# Altium schematic sheet deel3.SchDoc
size A4; SheetNumber: 3; SheetTotal: 4
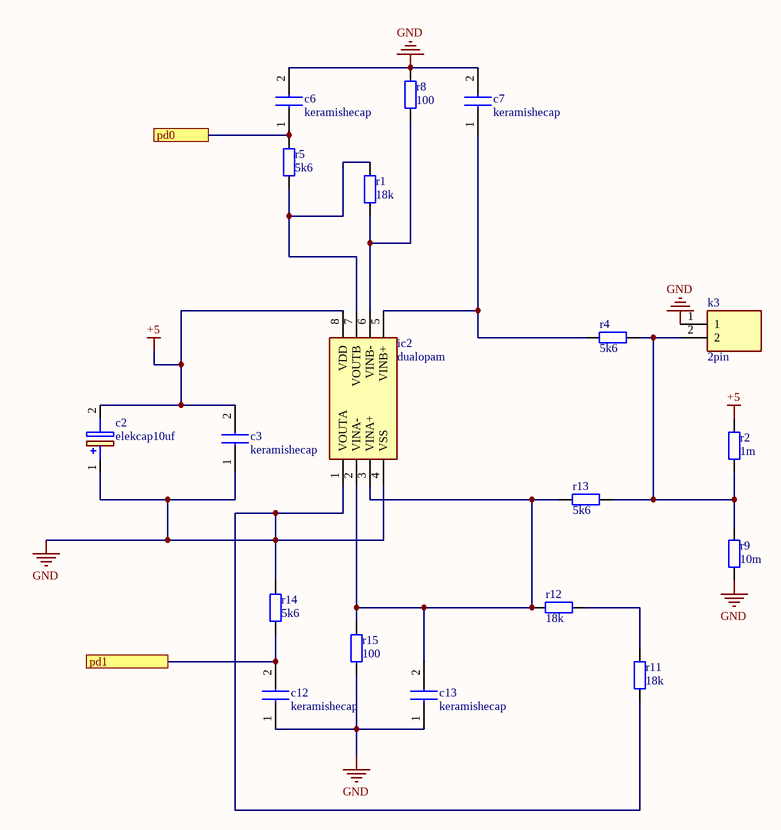
[diagram p0: deel3.SchDoc]

## Parts
c2  elekcap10uf  [elekcap10uf]
c3  keramishecap  [0805]
c6  keramishecap  [0805]
c7  keramishecap  [0805]
c12  keramishecap  [0805]
c13  keramishecap  [0805]
ic2  dualopam  [dualopam]
k3  2pin  [2pin]
r1  18k  [0805]
r2  1m  [0805]
r4  5k6  [0805]
r5  5k6  [0805]
r8  100  [0805]
r9  10m  [0805]
r11  18k  [0805]
r12  18k  [0805]
r13  5k6  [0805]
r14  5k6  [0805]
r15  100  [0805]

## Ports
pd0, pd1

## Nets
+5: c2.2(-) c3.2 ic2.8(VDD) r2.2
GND: c2.1(+) c3.1 c6.2 c7.2 c12.1 c13.1 ic2.1(VOUTA) ic2.4(VSS) k3.1 r8.2 r9.1 r11.1 r14.2 r15.1
pd0: c6.1 r5.1 ; port pd0
pd1: c12.2 r14.1 ; port pd1
Netc7_1: c7.1 ic2.5(VINB+) r4.1
Netc13_2: c13.2 ic2.2(VINA-) ic2.3(VINA+) r12.1 r13.1 r15.2
Netic2_6: ic2.6(VINB-) r1.1 r8.1
Netic2_7: ic2.7(VOUTB) r1.2 r5.2
Netk3_2: k3.2 r2.1 r4.2 r9.2 r13.2
Netr11_2: r11.2 r12.2

## Library data of the parts
c2 = elekcap10uf: Capacitor Polarised; Manufacturer_Name: Panasonic; Manufacturer_Part_Number: EEU-FR1H100; Datasheet Link: https://componentsearchengine.com//EEU-FR1H100.pdf; Height: 12.5mm; Mouser2 Part Number: 667-EEU-FR1H100; Mouser2 Price/Stock: https://www.mouser.com/Search/Refine.aspx?Keyword=667-EEU-FR1H100
c3 c6 c7 c12 c13 = keramishecap: Capacitor; Manufacturer_Name: Kemet; Manufacturer_Part_Number: C1206C104K3GACAUTO; Datasheet Link: https://www.kemet.com/specsheet/C1206C104K3GACAUTO; Height: 1.8mm
ic2 = dualopam: Integrated Circuit; Manufacturer_Name: Microchip; Manufacturer_Part_Number: MCP6002-E/P; Datasheet Link: https://componentsearchengine.com//MCP6002-E_P.pdf; Height: 5.334mm; Mouser2 Part Number: 579-MCP6002-E/P; Mouser2 Price/Stock: https://www.mouser.com/Search/Refine.aspx?Keyword=579-MCP6002-E%2FP
k3 = 2pin: Connector; Manufacturer_Name: Amphenol; Manufacturer_Part_Number: 10129378-902001BLF; Datasheet Link: https://www.mouser.co.uk/datasheet/2/18/10129378-1530218.pdf; Height: 8.43mm
r1 r2 r4 r5 r8 r9 r11-r15 = weerstand0805: WRIS-PSMB SMT Metal Plate Resistor, size 0805, 5mOhm, 0.5W; Manufacturer: Wurth Elektronik; Manufacturer Part Number: 580060720003; Rated Current: 10A; Temperature Coefficient of Resistance: +/-100ppm/degC; Technical Reference: MB0805R005F102KAATP0000; Resistance Tolerance: +/-1%; ComponentLink1Description: Manufacturer; ComponentLink1URL: http://www.we-online.de; ComponentLink2Description: Datasheet; ComponentLink2URL: https://www.we-online.com/catalog/datasheet/580060720003.pdf; Rated Power: 0.5W; Resistance: 5mOhm; Mounting Technology: SMT; Height: 0.35mm; Packaging: Tape and Reel; Published Date: May 2020; Size: 0805; Length: 2mm; Operating Temperature: -55 to +155degC; Width: 1.25mm